# Altium schematic sheet SuperCap-NEW_V2.1.2.SchDoc
size 500 x 449 mm
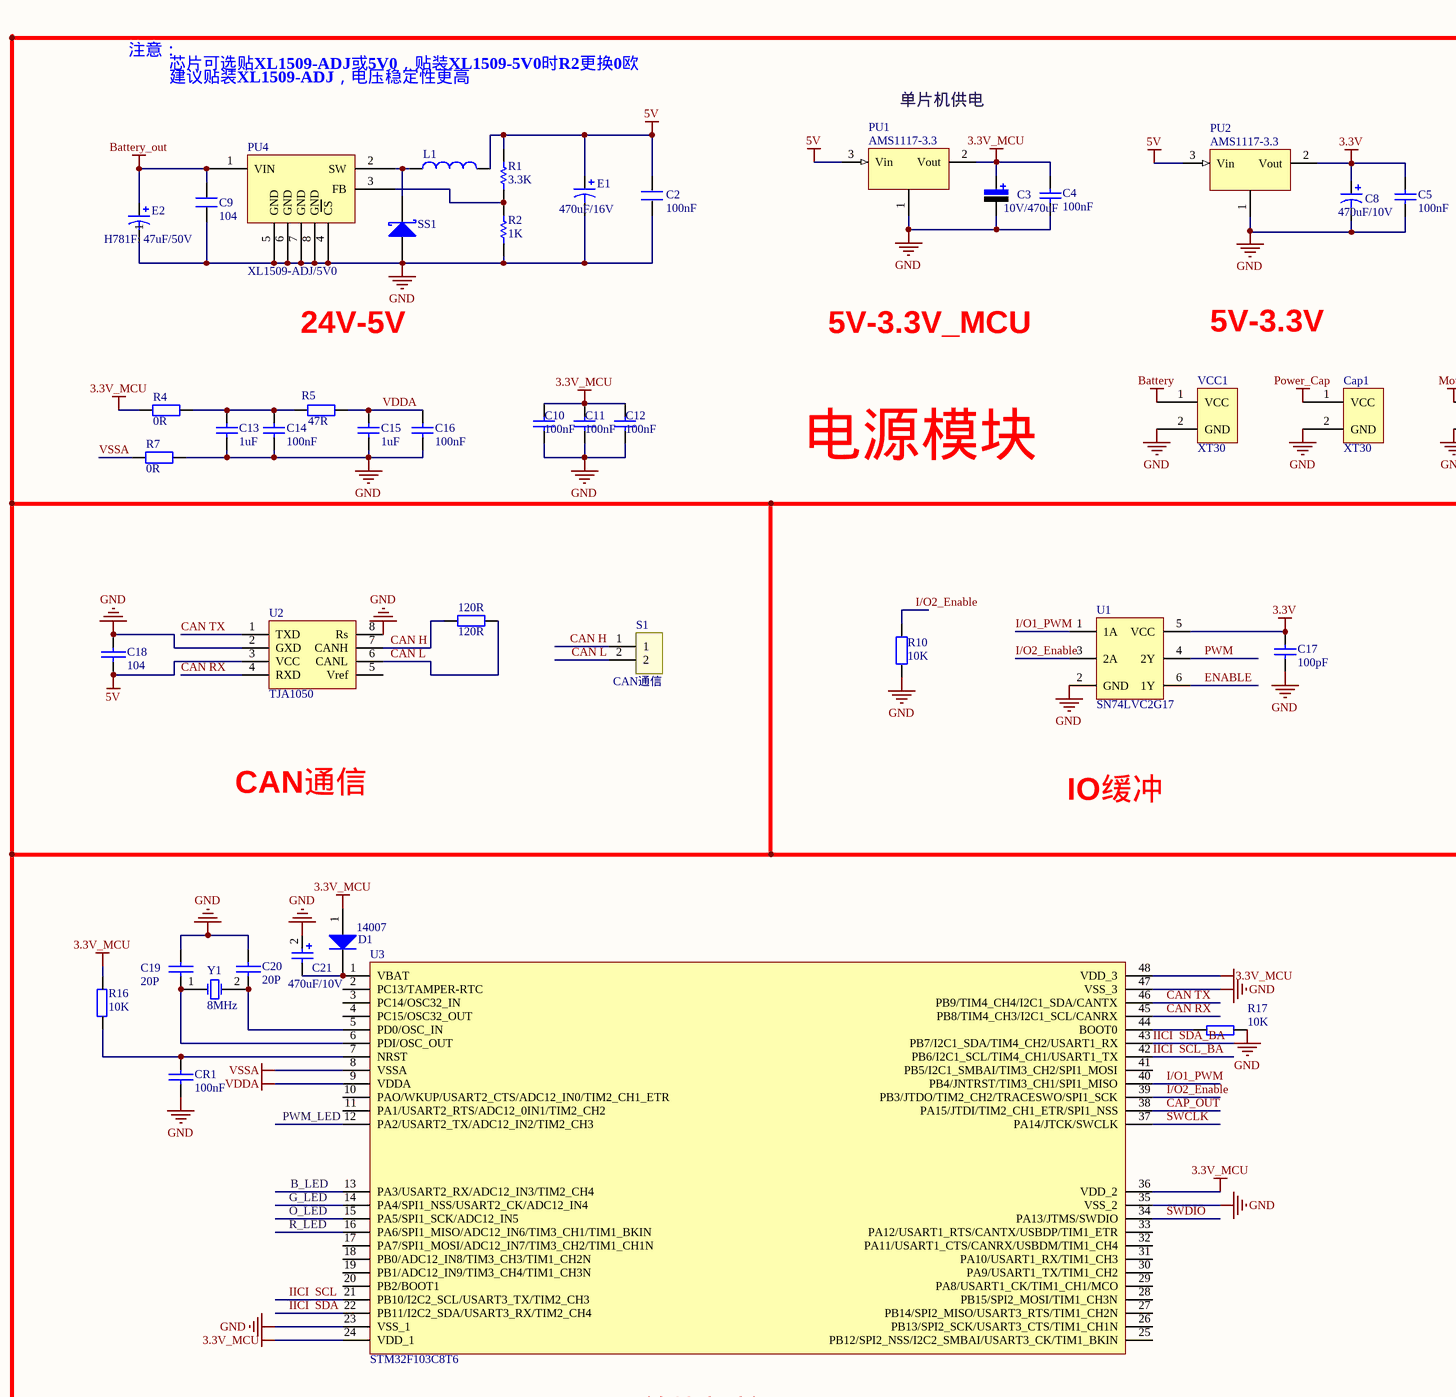
[diagram p0: SuperCap-NEW_V2.1.2.SchDoc, top left]
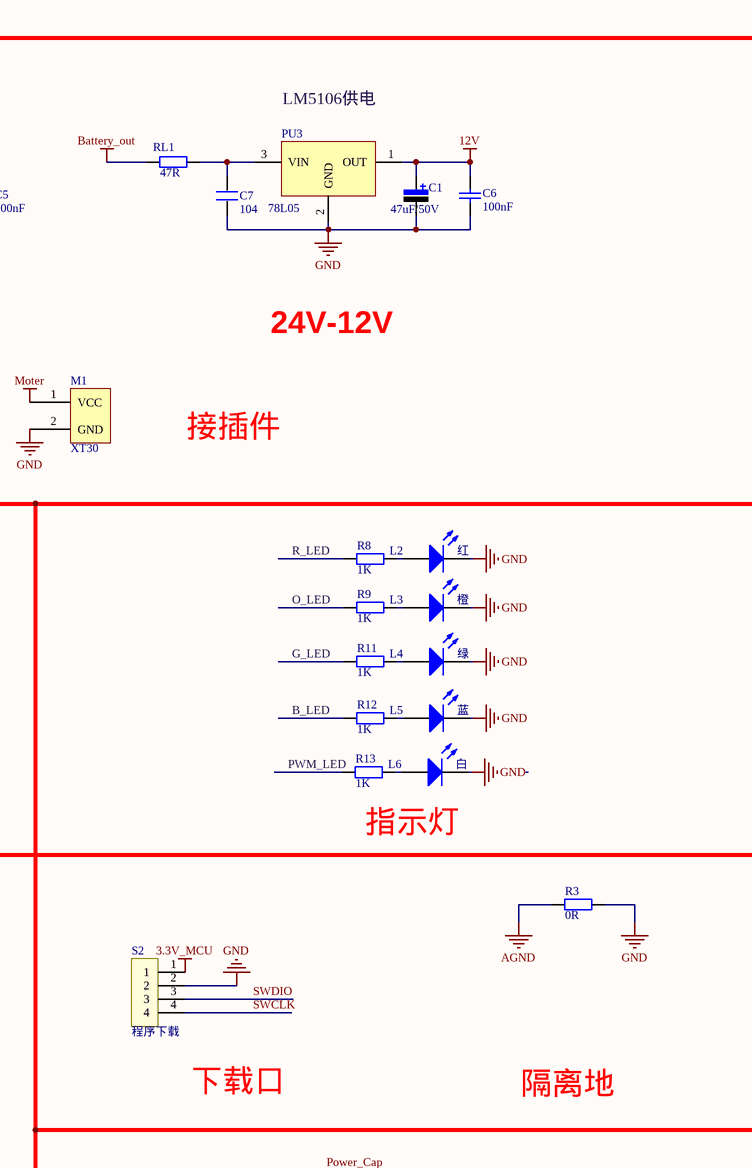
[diagram p1: SuperCap-NEW_V2.1.2.SchDoc, top right]
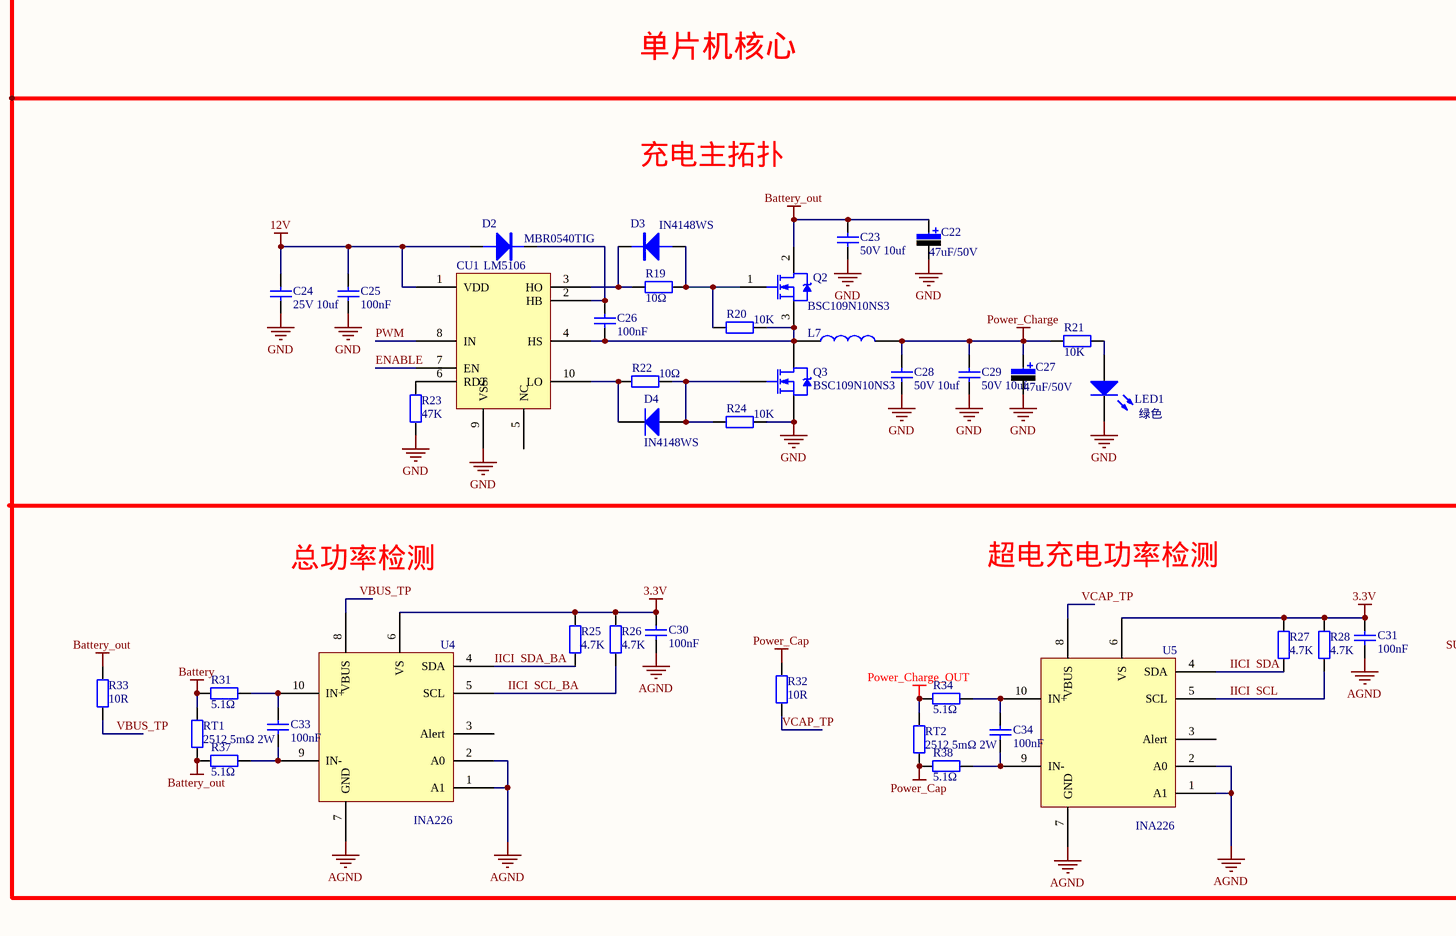
[diagram p2: SuperCap-NEW_V2.1.2.SchDoc, bottom left]
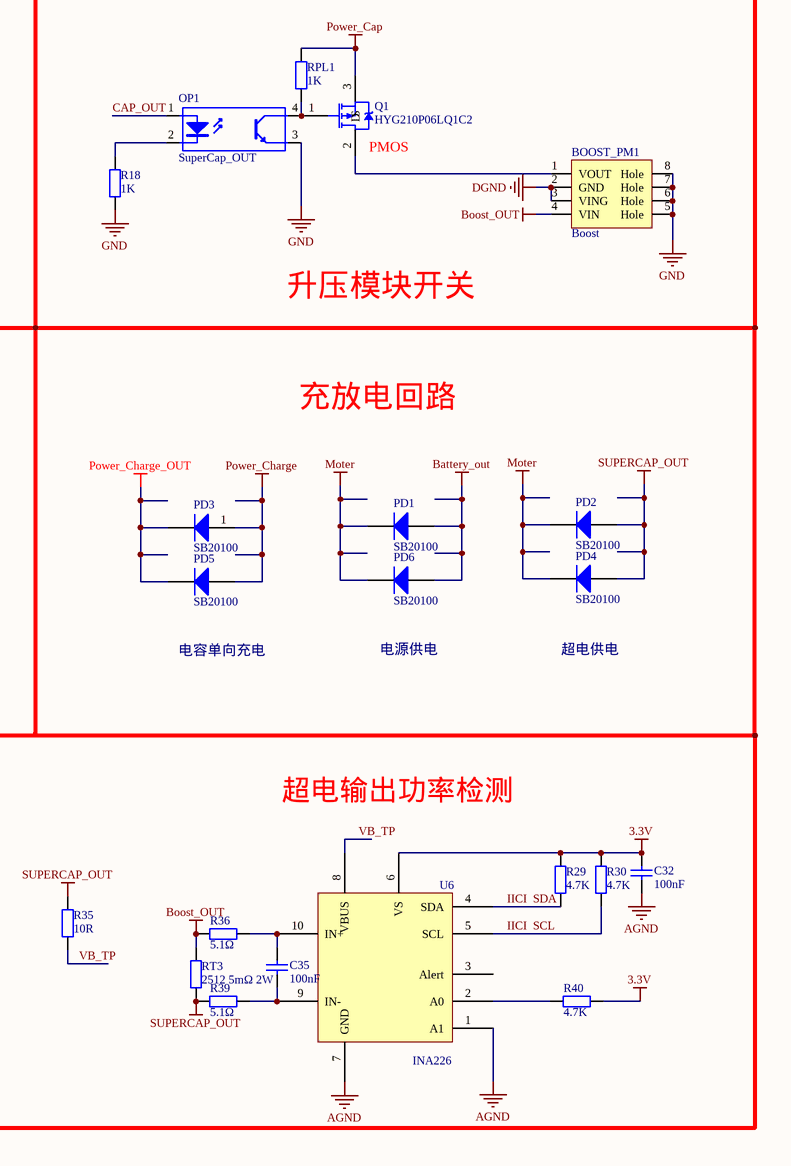
[diagram p3: SuperCap-NEW_V2.1.2.SchDoc, bottom right]

## Parts
120R  value 120R  [0603-1]  (hidden comment: Res2)
BOOST_PM1  Boost  [Boost_Block]
C1  47uF/50V  [CAP-SMD_BD6.3-L6.6-W6.6-FD]
C2  100nF  [0603C]
C3  10V/470uF  [CAP-SMD_BD6.3-L6.6-W6.6-FD]
C4  100nF  [0603C]
C5  100nF  [0603C]
C6  100nF  [0603C]
C7  104  [0603C]
C8  value 470uF/10V  [CAP-SMD_BD6.3-L6.6-W6.6-FD]  (hidden comment: Cap Pol1)
C9  104  [0603C]
C10  100nF  [0603C]
C11  100nF  [0603C]
C12  100nF  [0603C]
C13  1uF  [0603C]
C14  100nF  [0603C]
C15  1uF  [0603C]
C16  100nF  [0603C]
C17  value 100pF  [0603C]  (hidden comment: Cap)
C18  104  [0603C]
C19  20P  [0603C]
C20  20P  [0603C]
C21  470uF/10V  [CAP-SMD_BD6.3-L6.6-W6.6-FD]
C22  47uF/50V  [CAP-SMD_BD8.0-L8.3-W8.3-FD]
C23  50V 10uf  [0603C]
C24  25V 10uf  [0603C]
C25  100nF  [0603C]
C26  100nF  [0603C]
C27  47uF/50V  [CAP-SMD_BD8.0-L8.3-W8.3-FD]
C28  50V 10uf  [0603C]
C29  50V 10uf  [0603C]
C30  100nF  [0603C]
C31  100nF  [0603C]
C32  100nF  [0603C]
C33  100nF  [0603C]
C34  100nF  [0603C]
C35  100nF  [0603C]
Cap1  XT30  [XT30]
CR1  100nF  [0603C]
CU1  LM5106  [MSOP_10]
D1  14007  [SOD123]
D2  MBR0540TIG  [SOD123]
D3  IN4148WS  [SOD123]
D4  IN4148WS  [SOD123]
E1  value 470uF/16V  [CAP-SMD_BD8.0-L8.3-W8.3-FD]  (hidden comment: Cap Pol1)
E2  H781F: 47uF/50V  [CAP-SMD_BD8.0-L8.3-W8.3-FD]  (hidden comment: Cap Pol1)
L1  Inductor  [L 6*6]  (value not drawn)
L2  红  [LED_0805]
L3  橙  [LED_0805]
L4  绿  [LED_0805]
L5  蓝  [LED_0805]
L6  白  [LED_0805]
L7  68UH  [IND-TH_L14.0-W6.5-P8.00-D0.6]  (value not drawn)
LED1  绿色  [LED_0805]
M1  XT30  [XT30]
OP1  SuperCap_OUT  [SOP-4_L6.5-W4.6-P2.54-LS10.2-TL]
PD1  SB20100  [TO-277_3P-L5.4-W4.0-LS6.5-TR]
PD2  SB20100  [TO-277_3P-L5.4-W4.0-LS6.5-TR]
PD3  SB20100  [TO-277_3P-L5.4-W4.0-LS6.5-TR]
PD4  SB20100  [TO-277_3P-L5.4-W4.0-LS6.5-TR]
PD5  SB20100  [TO-277_3P-L5.4-W4.0-LS6.5-TR]
PD6  SB20100  [TO-277_3P-L5.4-W4.0-LS6.5-TR]
PU1  AMS1117-3.3  [SOT-223]
PU2  AMS1117-3.3  [SOT-223]
PU3  78L05  [SOT-89-3_L4.5-W2.5-P1.50-LS4.2-BR]
PU4  XL1509-ADJ/5V0  [SOP8 N]
Q1  HYG210P06LQ1C2  [MOS_PQFN]
Q2  BSC109N10NS3  [PDFN-8_L4.9-W5.8-P1.27-LS6.1-BL_2]
Q3  BSC109N10NS3  [PDFN-8_L4.9-W5.8-P1.27-LS6.1-BL_2]
R1  value 3.3K  [R0603]  (hidden comment: Res1)
R2  value 1K  [R0603]  (hidden comment: Res1)
R3  value 0R  [0603-1]  (hidden comment: Res2)
R4  0R  [0603-1]
R5  47R  [0603-1]
R7  0R  [0603-1]
R8  value 1K  [0603-1]  (hidden comment: Res2)
R9  value 1K  [0603-1]  (hidden comment: Res2)
R10  value 10K  [0603-1]  (hidden comment: Res2)
R11  value 1K  [0603-1]  (hidden comment: Res2)
R12  value 1K  [0603-1]  (hidden comment: Res2)
R13  value 1K  [0603-1]  (hidden comment: Res2)
R16  10K  [0603-1]
R17  10K  [0603-1]
R18  1K  [0603-1]
R19  10Ω  [0603-1]
R20  10K  [0603-1]
R21  10K  [0603-1]
R22  10Ω  [0603-1]
R23  47K  [0603-1]
R24  10K  [0603-1]
R25  4.7K  [0603-1]
R26  4.7K  [0603-1]
R27  4.7K  [0603-1]
R28  4.7K  [0603-1]
R29  4.7K  [0603-1]
R30  4.7K  [0603-1]
R31  5.1Ω  [0603-1]
R32  value 10R  [0603-1]  (hidden comment: Res2)
R33  value 10R  [0603-1]  (hidden comment: Res2)
R34  5.1Ω  [0603-1]
R35  value 10R  [0603-1]  (hidden comment: Res2)
R36  5.1Ω  [0603-1]
R37  5.1Ω  [0603-1]
R38  5.1Ω  [0603-1]
R39  5.1Ω  [0603-1]
R40  value 4.7K  [0603-1]  (hidden comment: Res2)
RL1  47R  [0603-1]
RPL1  1K  [0603-1]
RT1  2512 5mΩ 2W  [FUSE-SMD_L6.1-W2.7 - duplicate]
RT2  2512 5mΩ 2W  [FUSE-SMD_L6.1-W2.7 - duplicate]
RT3  2512 5mΩ 2W  [FUSE-SMD_L6.1-W2.7 - duplicate]
S1  CAN通信  [1.25_2Pin]
S2  程序下载  [S-4]
SS1  D Schottky  [贴片M7]  (value not drawn)
U1  SN74LVC2G17  [SOT-23-6_L2.9-W1.6-P0.95-LS2.8-BR]
U2  TJA1050  [SOP8 N]
U3  STM32F103C8T6  [LQFP-48_M]
U4  INA226  [MSOP_10]
U5  INA226  [MSOP_10]
U6  INA226  [MSOP_10]
VCC1  XT30  [XT30]
Y1  8MHz  [X-SM49]

## Nets
3.3V: C5.1 C8.1 C17.2 C30.1 C31.1 C32.1 PU2.2(Vout) R25.1 R26.1 R27.1 R28.1 R29.1 R30.1 R40.2 U1.5(VCC) U4.6(VS) U5.6(VS) U6.6(VS)
3.3V_MCU: C3.1 C4.1 C10.1 C11.1 C12.1 D1.1(A) PU1.2(Vout) R4.1 R16.1 S2.1 U3.24(VDD_1) U3.36(VDD_2) U3.48(VDD_3)
5V: C2.2 C18.2 E1.1 L1.2 PU1.3(Vin) PU2.3(Vin) R1.2 U2.3(VCC)
12V: C1.1 C6.1 C24.1 C25.1 CU1.1(VDD) D2.1 PU3.1(OUT)
AGND: C30.2 C31.2 C32.2 R3.1 U4.1(A1) U4.2(A0) U4.7(GND) U5.1(A1) U5.2(A0) U5.7(GND) U6.1(A1) U6.7(GND)
Battery: R31.2 RT1.1 VCC1.1(VCC)
Battery_out: C9.2 C22.1 C23.1 E2.1 PD1.1(A) PD6.1(A) PU4.1(VIN) Q2.2(D) R33.1 R37.2 RL1.1 RT1.2
Boost_OUT: BOOST_PM1.4(VIN) R36.2 RT3.1
DGND: BOOST_PM1.2(GND) BOOST_PM1.3(VING)
GND: BOOST_PM1.5(Hole) BOOST_PM1.6(Hole) BOOST_PM1.7(Hole) BOOST_PM1.8(Hole) C1.2 C2.1 C3.2 C4.2 C5.2 C6.2 C7.1 C8.2 C9.1 C10.2 C11.2 C12.2 C13.1 C14.2 C15.2 C16.2 C17.1 C18.1 C19.1 C20.1 C21.2 C22.2 C23.2 C24.2 C25.2 C27.2 C28.2 C29.2 Cap1.2(GND) CR1.2 CU1.9(VSS) E1.2 E2.2 L2.2(K) L3.2(K) L4.2(K) L5.2(K) L6.2(K) LED1.2(K) M1.2(GND) OP1.3(E) PU1.1 PU2.1 PU3.2(GND) PU4.4(CS) PU4.5(GND) PU4.6(GND) PU4.7(GND) PU4.8(GND) Q3.3(S) R2.1 R3.2 R7.2 R10.2 R17.2 R18.2 R23.2 R24.2 S2.2 SS1.1(A) U1.2(GND) U2.2(GXD) U2.8(Rs) U3.23(VSS_1) U3.35(VSS_2) U3.47(VSS_3) VCC1.2(GND)
Moter: M1.1(VCC) PD1.2(K) PD2.2(K) PD4.2(K) PD6.2(K)
Power_Cap: Cap1.1(VCC) Q1.3(S) R32.1 R38.2 RPL1.1 RT2.2
Power_Charge: C27.1 C28.1 C29.1 L7.2 PD3.1(A) PD5.1(A) R21.2
Power_Charge_OUT: PD3.2(K) PD5.2(K) R34.2 RT2.1
SUPERCAP_OUT: PD2.1(A) PD4.1(A) R35.1 R39.2 RT3.2
VDDA: C15.1 C16.1 R5.2 U3.9(VDDA)
VSSA: R7.1 U3.8(VSSA)
B_LED: R12.2 U3.13(PA3/USART2_RX/ADC12_IN3/TIM2_CH4)
CAN H: 120R.1 S1.1 U2.7(CANH)
CAN L: 120R.2 S1.2 U2.6(CANL)
CAN RX: U2.4(RXD) U3.45(PB8/TIM4_CH3/I2C1_SCL/CANRX)
CAN TX: U2.1(TXD) U3.46(PB9/TIM4_CH4/I2C1_SDA/CANTX)
CAP_OUT: OP1.1(A) U3.38(PA15/JTDI/TIM2_CH1_ETR/SPI1_NSS)
ENABLE: CU1.7(EN) U1.6(1Y)
G_LED: R11.2 U3.14(PA4/SPI1_NSS/USART2_CK/ADC12_IN4)
I/O1_PWM: U1.1(1A) U3.40(PB4/JNTRST/TIM3_CH1/SPI1_MISO)
I/O2_Enable: R10.1 U1.3(2A) U3.39(PB3/JTDO/TIM2_CH2/TRACESWO/SPI1_SCK)
IICI  SCL: R28.2 R30.2 U3.21(PB10/I2C2_SCL/USART3_TX/TIM2_CH3) U5.5(SCL) U6.5(SCL)
IICI  SCL_BA: R26.2 U3.42(PB6/I2C1_SCL/TIM4_CH1/USART1_TX) U4.5(SCL)
IICI  SDA: R27.2 R29.2 U3.22(PB11/I2C2_SDA/USART3_RX/TIM2_CH4) U5.4(SDA) U6.4(SDA)
IICI  SDA_BA: R25.2 U3.43(PB7/I2C1_SDA/TIM4_CH2/USART1_RX) U4.4(SDA)
O_LED: R9.2 U3.15(PA5/SPI1_SCK/ADC12_IN5)
PWM: CU1.8(IN) U1.4(2Y)
PWM_LED: R13.2 U3.12(PA2/USART2_TX/ADC12_IN2/TIM2_CH3)
R_LED: R8.1 U3.16(PA6/SPI1_MISO/ADC12_IN6/TIM3_CH1/TIM1_BKIN)
SWCLK: S2.4 U3.37(PA14/JTCK/SWCLK)
SWDIO: S2.3 U3.34(PA13/JTMS/SWDIO)
VB_TP: R35.2 U6.8(VBUS)
VBUS_TP: R33.2 U4.8(VBUS)
VCAP_TP: R32.2 U5.8(VBUS)
NetBOOST_PM1_1: BOOST_PM1.1(VOUT) Q1.2(D)
NetC7_2: C7.2 PU3.3(VIN) RL1.2
NetC13_2: C13.2 C14.1 R4.2 R5.1
NetC19_2: C19.2 U3.6(PDI/OSC_OUT) Y1.1(OSC1)
NetC20_2: C20.2 U3.5(PD0/OSC_IN) Y1.2(OSC2)
NetC21_1: C21.1 D1.2(K) U3.1(VBAT)
NetC26_1: C26.1 CU1.2(HB) D2.2
NetC26_2: C26.2 CU1.4(HS) L7.1 Q2.3(S) Q3.2(D) R20.2
NetC33_1: C33.1 R31.1 U4.10(IN+)
NetC33_2: C33.2 R37.1 U4.9(IN-)
NetC34_1: C34.1 R34.1 U5.10(IN+)
NetC34_2: C34.2 R38.1 U5.9(IN-)
NetC35_1: C35.1 R36.1 U6.10(IN+)
NetC35_2: C35.2 R39.1 U6.9(IN-)
NetCR1_1: CR1.1 R16.2 U3.7(NRST)
NetCU1_3: CU1.3(HO) D3.2 R19.1
NetCU1_6: CU1.6(RDT) R23.1
NetCU1_10: CU1.10(LO) D4.2(K) R22.1
NetD3_1: D3.1 Q2.1(G) R19.2 R20.1
NetD4_1: D4.1(A) Q3.1(G) R22.2 R24.1
NetL1_1: L1.1 PU4.2(SW) SS1.2(K)
NetL2_1: L2.1(A) R8.2
NetL3_1: L3.1(A) R9.1
NetL4_1: L4.1(A) R11.1
NetL5_1: L5.1(A) R12.1
NetL6_1: L6.1(A) R13.1
NetLED1_1: LED1.1(A) R21.1
NetOP1_2: OP1.2(K) R18.1
NetOP1_4: OP1.4(C) Q1.1(G) RPL1.2
NetPU4_3: PU4.3(FB) R1.1 R2.2
NetR17_1: R17.1 U3.44(BOOT0)
NetR40_1: R40.1 U6.2(A0)

Not connected (* = marked no-connect by the designer): CU1 5(NC); U2 5(Vref); U3 2(PC13/TAMPER-RTC) 3(PC14/OSC32_IN) 4(PC15/OSC32_OUT) 10(PAO/WKUP/USART2_CTS/ADC12_IN0/TIM2_CH1_ETR) 11(PA1/USART2_RTS/ADC12_0IN1/TIM2_CH2) 17(PA7/SPI1_MOSI/ADC12_IN7/TIM3_CH2/TIM1_CH1N) 18(PB0/ADC12_IN8/TIM3_CH3/TIM1_CH2N) 19(PB1/ADC12_IN9/TIM3_CH4/TIM1_CH3N) 20(PB2/BOOT1) 25(PB12/SPI2_NSS/I2C2_SMBAI/USART3_CK/TIM1_BKIN) 26(PB13/SPI2_SCK/USART3_CTS/TIM1_CH1N) 27(PB14/SPI2_MISO/USART3_RTS/TIM1_CH2N) 28(PB15/SPI2_MOSI/TIM1_CH3N) 29(PA8/USART1_CK/TIM1_CH1/MCO) 30(PA9/USART1_TX/TIM1_CH2) 31(PA10/USART1_RX/TIM1_CH3) 32(PA11/USART1_CTS/CANRX/USBDM/TIM1_CH4) 33(PA12/USART1_RTS/CANTX/USBDP/TIM1_ETR) 41(PB5/I2C1_SMBAI/TIM3_CH2/SPI1_MOSI); U4 3(Alert); U5 3(Alert); U6 3(Alert)

## Notes on the sheet
- 注意：
- 芯片可选贴XL1509-ADJ或5V0，贴装XL1509-5V0时R2更换0欧
- 建议贴装XL1509-ADJ，电压稳定性更高
- 24V-5V
- 5V-3.3V_MCU
- 5V-3.3V
- 24V-12V
- 接插件
- 电源模块
- CAN通信
- IO缓冲
- 指示灯
- 下载口
- 隔离地
- (near Q1) PMOS
- 单片机核心
- 升压模块开关
- 充电主拓扑
- 充放电回路
- 电容单向充电
- 电源供电
- 超电供电
- 总功率检测
- 超电充电功率检测
- 超电输出功率检测
- Labels drawn without touching a wire or pin: LM5106供电, 单片机供电

## Library data of the parts
120R R3 R8-R13 R32 R33 R35 R40 = Res2: Resistor; Published: 8-Jun-2000; LatestRevisionDate: 17-Jul-2002; LatestRevisionNote: Re-released for DXP Platform.; PackageReference: AXIAL-0.4; Publisher: Altium Limited; PackageDescription: Axial Device, Thru-Hole; 2 Leads; 0.4 in Pin Spacing
C1 C3 C22 C27 = Cap Pol: 极性电解电容; Value: 100uF; Vol: 16V; Published: 8-Jun-2000; LatestRevisionDate: 17-Jul-2002; LatestRevisionNote: Re-released for DXP Platform.; PackageReference: RB7.6-15; Publisher: Altium Limited
C2 C7 C9 = C
C4-C6 C10-C12 C14 C16 C25 C26 C30-C35 = Cap: 无极性电容; Published: 8-Jun-2000; LatestRevisionDate: 17-Jul-2002; LatestRevisionNote: Re-released for DXP Platform.; PackageReference: RAD-0.3; Publisher: Altium Limited; Value: 100nF
C8 E1 E2 = Cap Pol1: Polarized Capacitor (Radial); Published: 8-Jun-2000; LatestRevisionDate: 17-Jul-2002; LatestRevisionNote: Re-released for DXP Platform.; PackageReference: RB7.6-15; Publisher: Altium Limited; PackageDescription: Polarized Capacitor (Radial); 2 Leads
C13 C15 C23 C24 C28 C29 = Cap: 无极性电容; Value: 100nF; Published: 8-Jun-2000; LatestRevisionDate: 17-Jul-2002; LatestRevisionNote: Re-released for DXP Platform.; PackageReference: RAD-0.3; Publisher: Altium Limited
C17 = Cap: Capacitor; Published: 8-Jun-2000; LatestRevisionDate: 17-Jul-2002; LatestRevisionNote: Re-released for DXP Platform.; PackageReference: RAD-0.3; Publisher: Altium Limited; PackageDescription: Radial Cap, Thru-Hole; 2 Leads; 0.3 in Pin Spacing
C18-C20 CR1 = CAP-1
C21 = Cap Pol1: Polarized Capacitor (Radial); Value: 10uF; Published: 8-Jun-2000; Revision: July-2002: Re-released for DXP Platform.; Publisher: Altium Limited
Cap1 M1 VCC1 = JP-2
CU1 U4-U6 = Component_1
D1 D4 PD1-PD6 = Diode 1N914: High Conductance Fast Diode; Published: 8-Jun-2000; LatestRevisionDate: 17-Jul-2002; LatestRevisionNote: Re-released for DXP Platform.; DatasheetVersion: 1997; PackageReference: DO-35; Publisher: Altium Limited; PackageDescription: Diode, Axial; Body 3.8 x 1.9 mm (LxDia. max), Lead Dia. 0.53 mm (max); Code_JEDEC: DO-204-AH; ComponentLink1Description: Manufacturer Link; ComponentLink1URL: http://www.fairchildsemi.com/; ComponentLink2Description: Datasheet; ComponentLink2URL: http://www.fairchildsemi.com/ds/1N%2F1N4448.pdf
D2 D3 = D-1
L1 = Inductor: Code_IEC: 1005; Value: 10mH; Published: 8-Jun-2000; LatestRevisionDate: 29-May-2009; LatestRevisionNote: IPC-7351 Footprint Added.; PackageReference: 0402-A; Publisher: Altium Limited; PackageDescription: Chip Inductor; Code_JEITA: 0402
L2-L6 LED1 = LED0: 发光二极管; Published: 8-Jun-2000; LatestRevisionDate: 08-Jul-2005; LatestRevisionNote: Mech Layer 1 removed.; PackageReference: LED-0; Publisher: Altium Limited
L7 = Inductance
OP1 = Optoisolator1: 4-Pin Phototransistor Optocoupler; Published: 24-Mar-1999; LatestRevisionDate: 04-Mar-2005; LatestRevisionNote: Sch pins 3 & 4 Swapped.; DatasheetVersion: Nov-2003; PackageReference: DIP-4; Publisher: Altium Limited
PU1 PU2 = LD1117
PU4 = XL1509-ADJ
Q1 = PMOS-2: P-Channel Power MOSFET; Note: Pin 4 not drawn and electrically connected to Pin 2.; Published: 8-Jun-2000; LatestRevisionDate: 17-Jul-2002; LatestRevisionNote: Re-released for DXP Platform.; DatasheetVersion: PD-9.390D; PackageVersion: Feb-1997; PackageReference: TO-220AB; Publisher: Altium Limited; PackageDescription: TO, Thru-Hole, Vertical, Heatsink Mounted; 3 In-Line Leads; Pitch 2.54 mm; ComponentLink1Description: Manufacturer Link; ComponentLink1URL: http://www.irf.com/
Q2 Q3 = NMOS-2: N-Channel Power MOSFET; Note: Pin 2 is electrically connected to pin 4.; Published: 8-Jun-2000; LatestRevisionDate: 17-Jul-2002; LatestRevisionNote: Re-released for DXP Platform.; DatasheetVersion: PD-9.814; PackageVersion: Feb-1997; PackageReference: TO-220AB; Publisher: Altium Limited; PackageDescription: TO, Thru-Hole, Vertical, Heatsink Mounted; 3 In-Line Leads; Pitch 2.54 mm; ComponentLink1Description: Manufacturer Link; ComponentLink1URL: http://www.irf.com/
R1 R2 = Res1: Resistor; Published: 8-Jun-2000; LatestRevisionDate: 17-Jul-2002; LatestRevisionNote: Re-released for DXP Platform.; PackageReference: AXIAL-0.3; Publisher: Altium Limited; PackageDescription: Axial Device, Thru-Hole; 2 Leads; 0.3 in Pin Spacing
R4 R5 R7 R19-R31 R34 R36-R39 RL1 RT1-RT3 = Res1: 贴片电阻; Value: 1K; Published: 8-Jun-2000; LatestRevisionDate: 17-Jul-2002; LatestRevisionNote: Re-released for DXP Platform.; PackageReference: AXIAL-0.4; Publisher: Altium Limited
R16 R17 = R
R18 RPL1 = Res1: 贴片电阻; Published: 8-Jun-2000; LatestRevisionDate: 17-Jul-2002; LatestRevisionNote: Re-released for DXP Platform.; PackageReference: AXIAL-0.4; Publisher: Altium Limited; Value: 1K
S1 = S-2
S2 = S-4
SS1 = D Schottky: Schottky Diode; Published: 8-Jun-2000; LatestRevisionDate: 17-Jul-2002; LatestRevisionNote: Re-released for DXP Platform.; PackageReference: SMB; Publisher: Altium Limited; PackageDescription: DO-214-AA/SMB; 2 C-Bend Leads; Body 5.3 x 3.6 mm, inc. leads (LxW); Code_JEDEC: DO-214-AA
U2 = 24C02
Y1 = XTAL: Crystal Oscillator; Published: 8-Jun-2000; LatestRevisionDate: 17-Jul-2002; LatestRevisionNote: Re-released for DXP Platform.; Publisher: Altium Limited